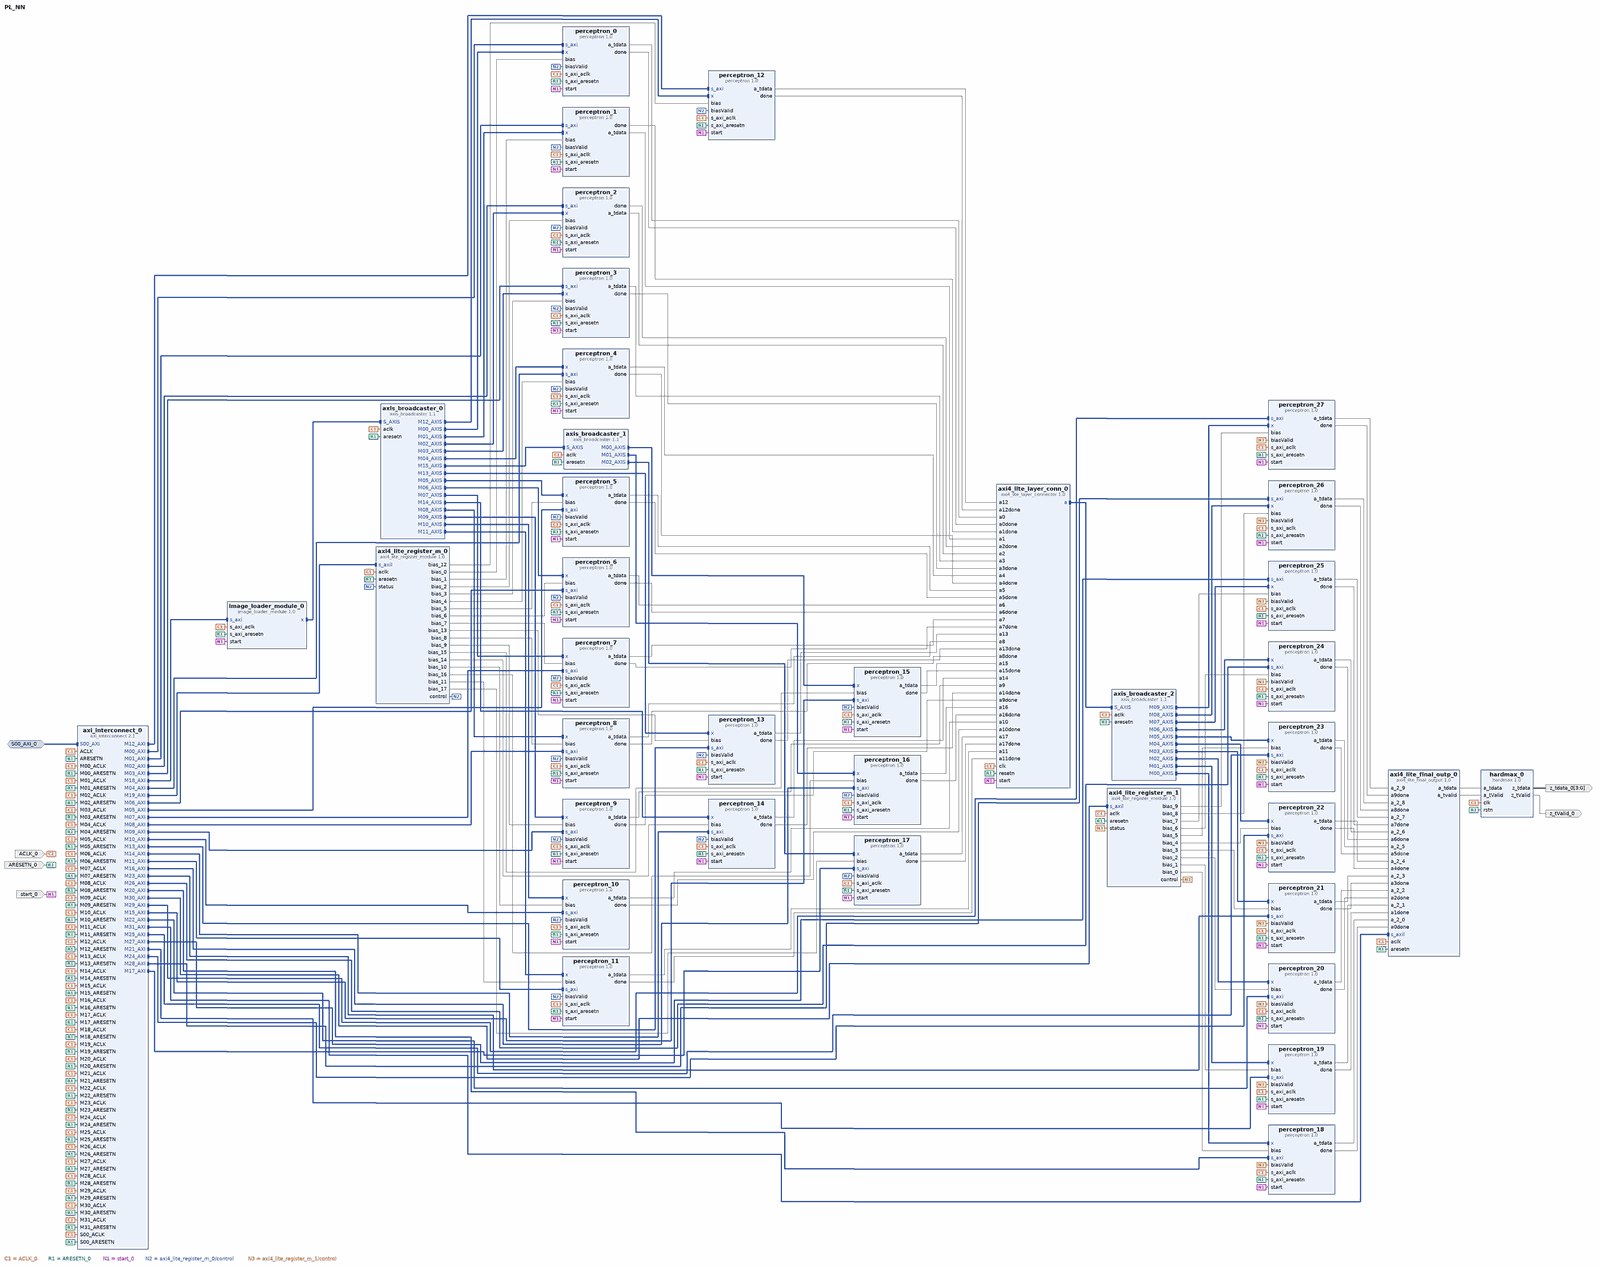
[diagram p0: block diagram of the top level, whole]
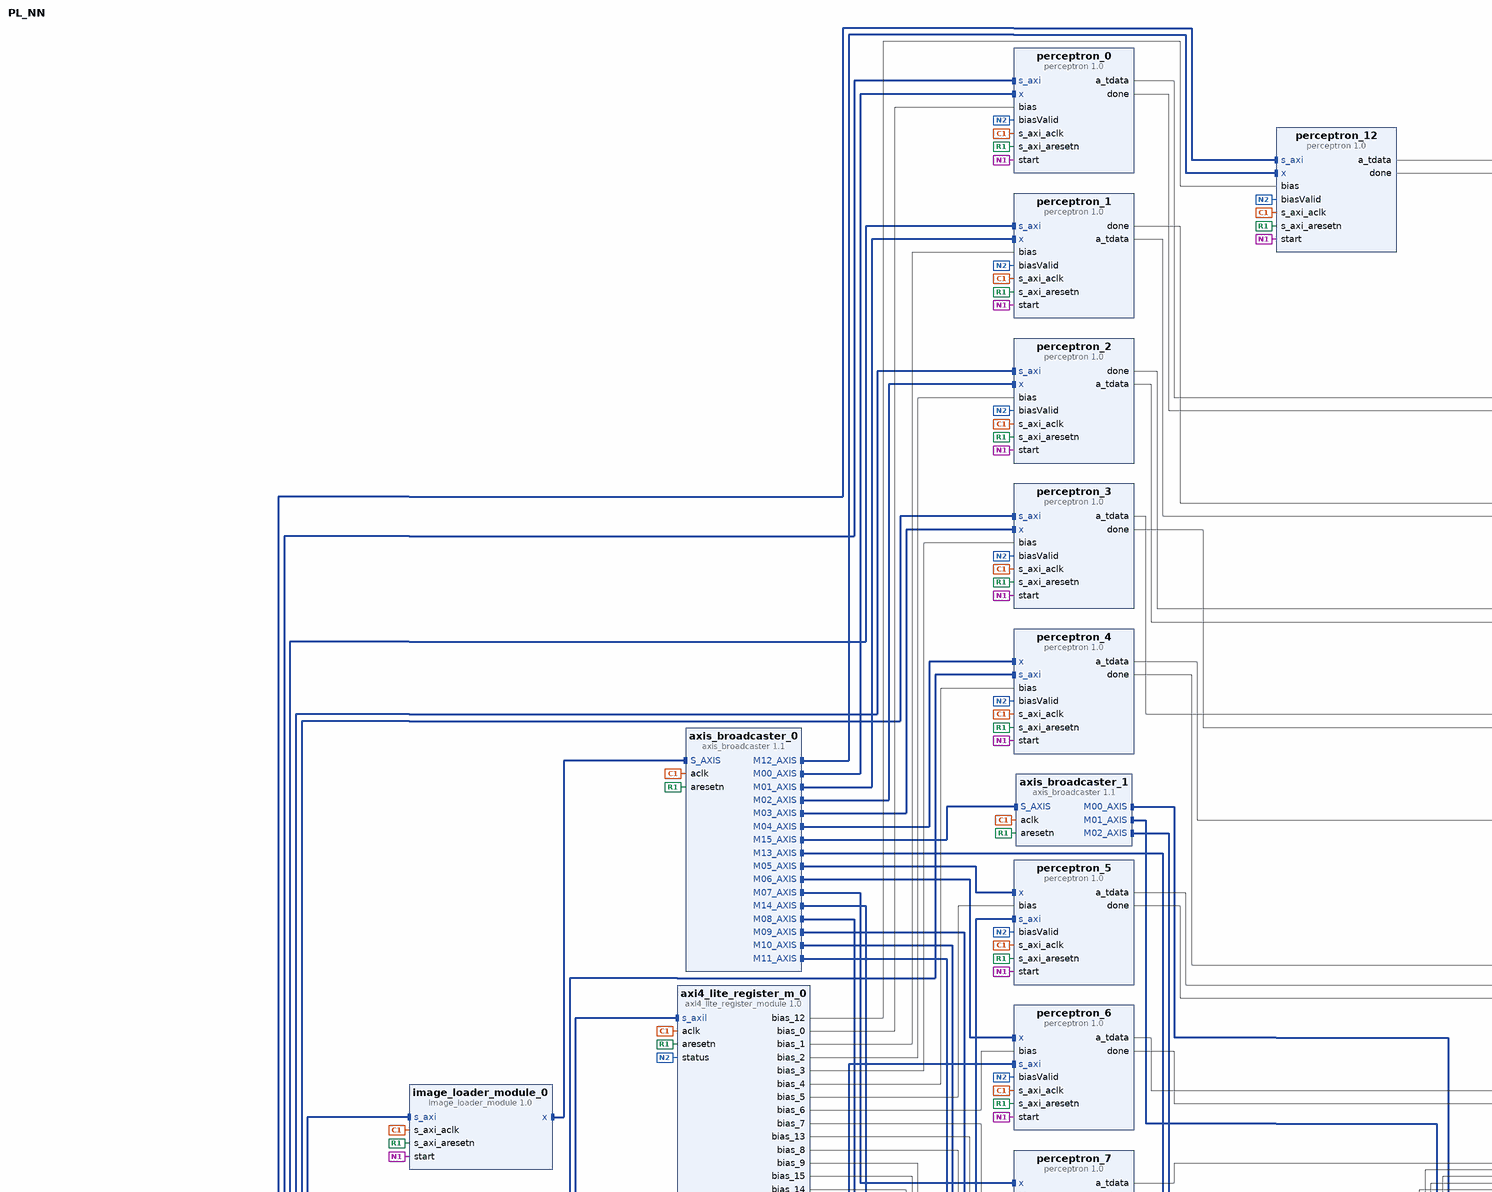
[diagram p1: block diagram of the top level, upper left part]
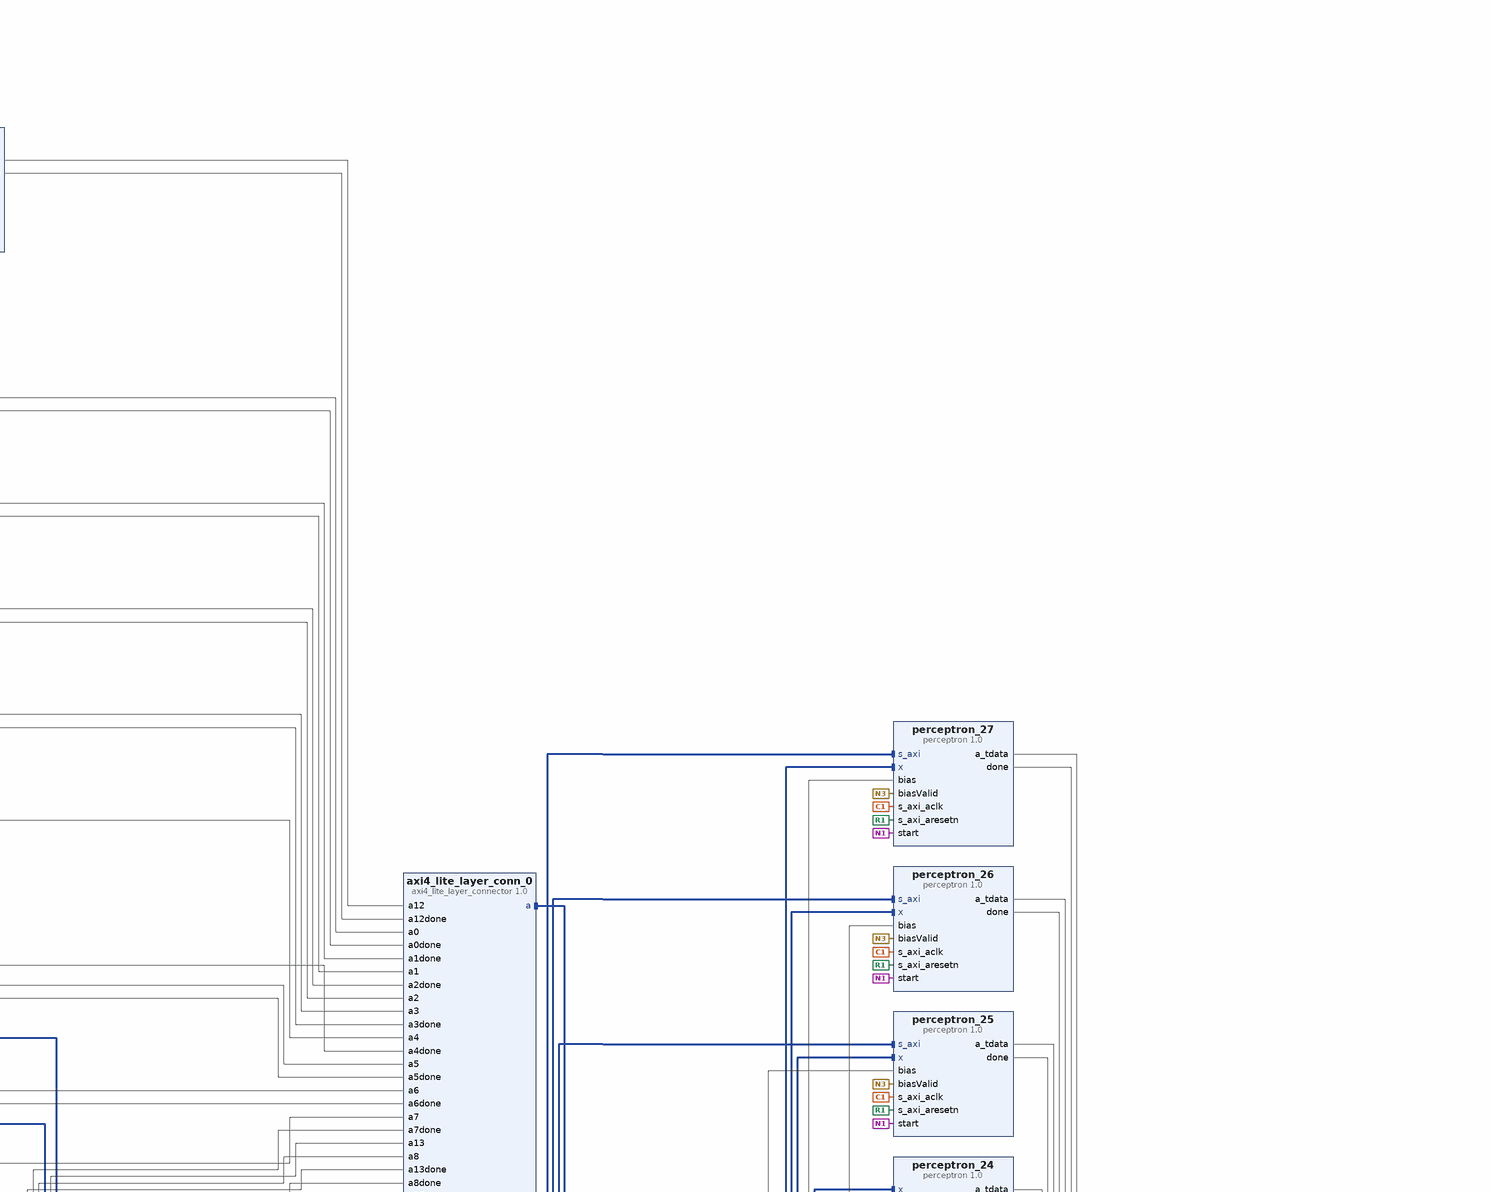
[diagram p2: block diagram of the top level, upper right part]
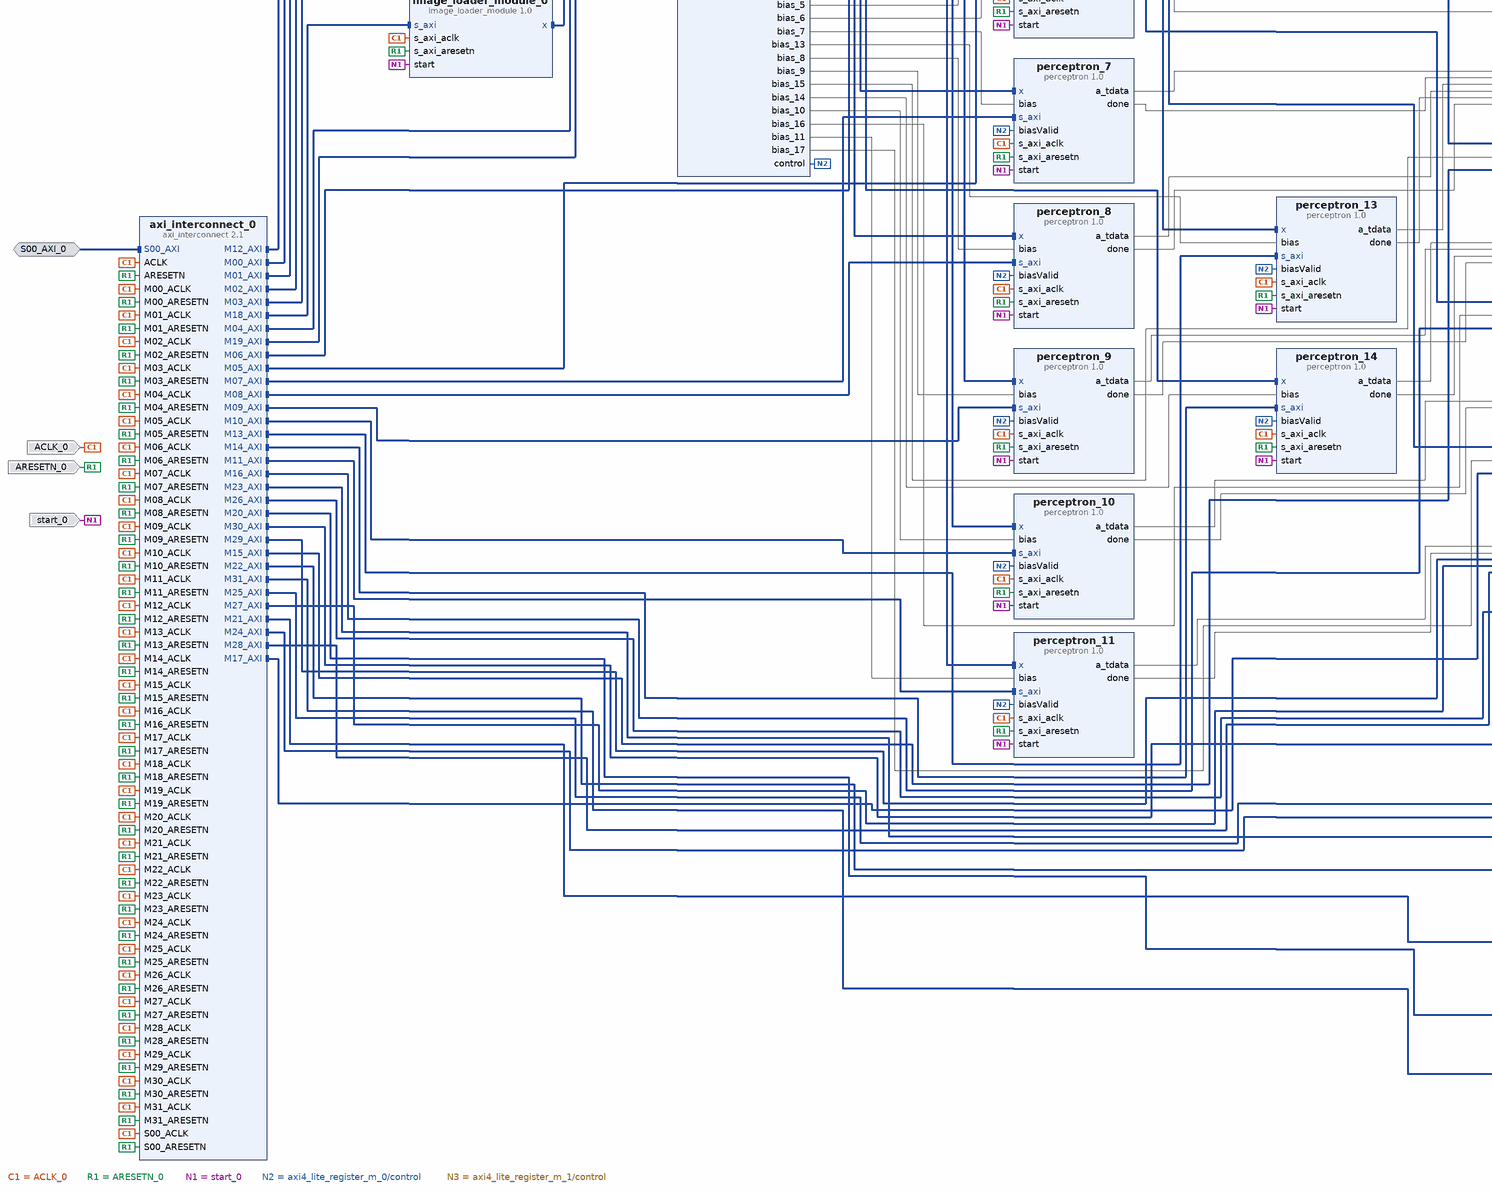
[diagram p3: block diagram of the top level, lower left part]
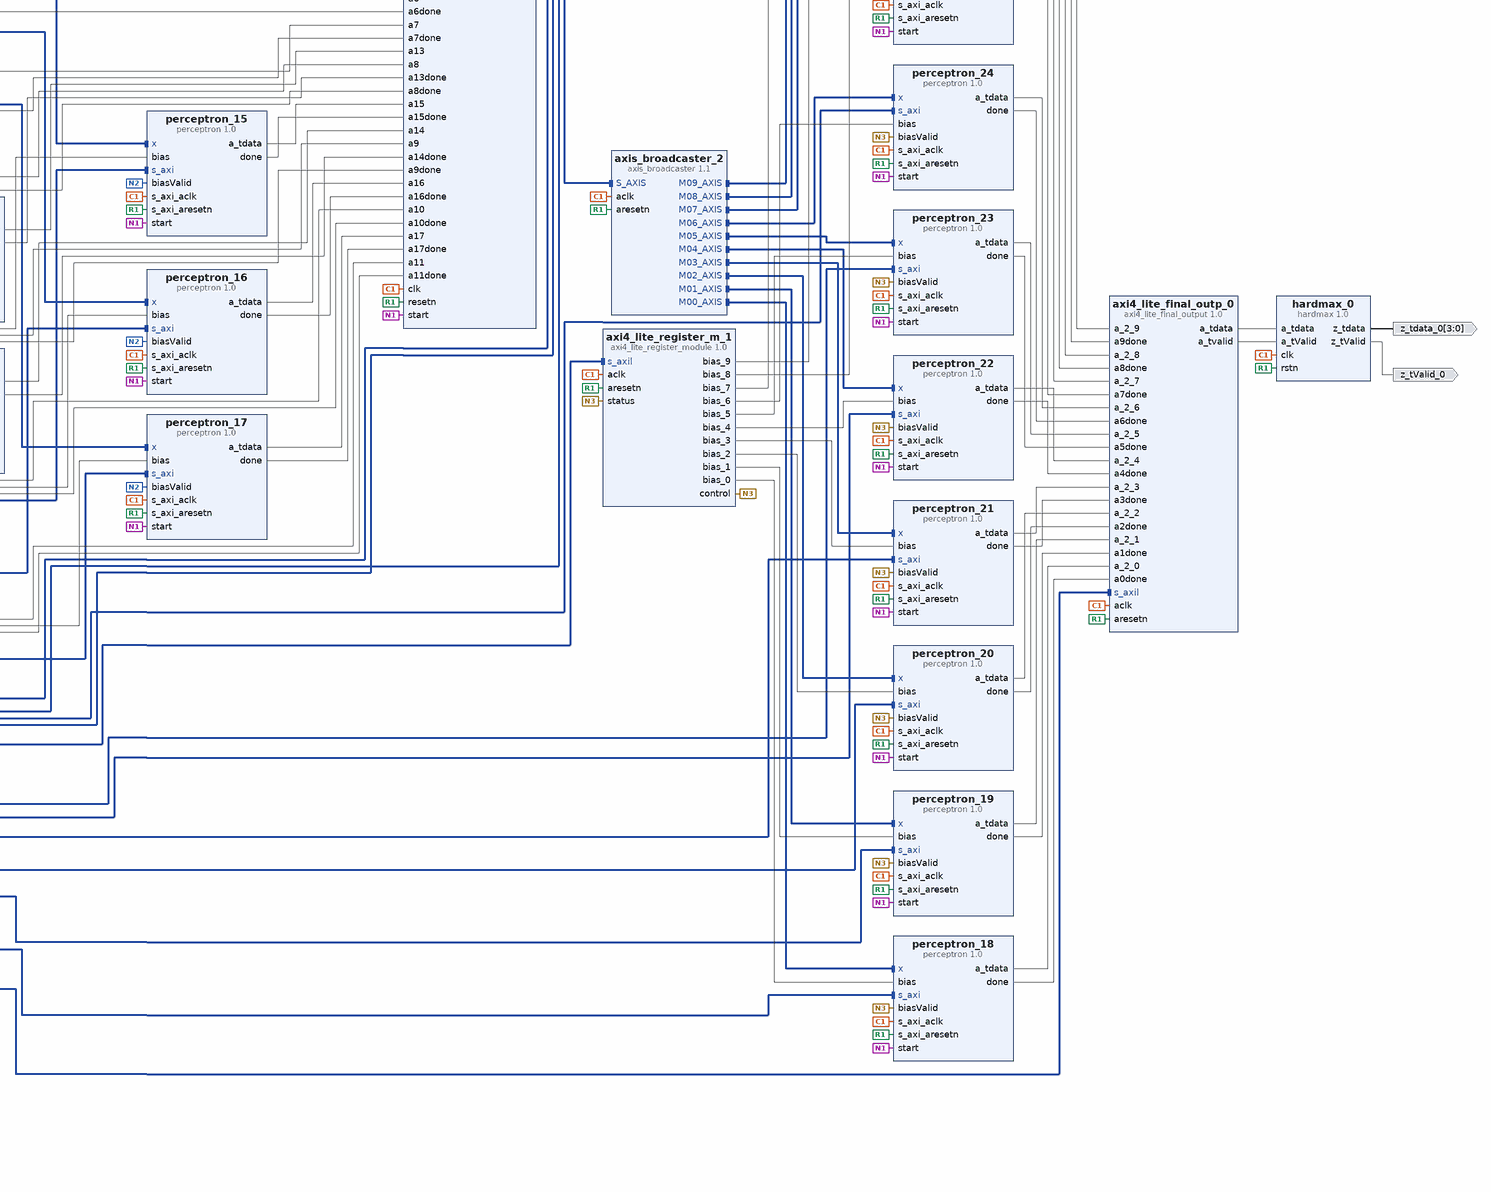
[diagram p4: block diagram of the top level, lower right part]
# Vivado block design PL_NN, xc7z010clg400-1, Vivado 2019.2
create_bd_design PL_NN

create_bd_intf_port -mode Slave -vlnv xilinx.com:interface:aximm_rtl:1.0 S00_AXI_0
set_property -dict [list \
  CONFIG.DATA_WIDTH 32 \
  CONFIG.PROTOCOL AXI4LITE \
  CONFIG.FREQ_HZ 10000000 \
  CONFIG.ID_WIDTH 0 \
  CONFIG.ADDR_WIDTH 24 \
  CONFIG.AWUSER_WIDTH 0 \
  CONFIG.ARUSER_WIDTH 0 \
  CONFIG.WUSER_WIDTH 0 \
  CONFIG.RUSER_WIDTH 0 \
  CONFIG.BUSER_WIDTH 0 \
  CONFIG.READ_WRITE_MODE READ_WRITE \
  CONFIG.HAS_BURST 1 \
  CONFIG.HAS_LOCK 1 \
  CONFIG.HAS_PROT 1 \
  CONFIG.HAS_CACHE 1 \
  CONFIG.HAS_QOS 1 \
  CONFIG.HAS_REGION 0 \
  CONFIG.HAS_WSTRB 1 \
  CONFIG.HAS_BRESP 1 \
  CONFIG.HAS_RRESP 1 \
  CONFIG.SUPPORTS_NARROW_BURST 0 \
  CONFIG.NUM_READ_OUTSTANDING 2 \
  CONFIG.NUM_WRITE_OUTSTANDING 2 \
  CONFIG.MAX_BURST_LENGTH 1 \
  CONFIG.NUM_READ_THREADS 1 \
  CONFIG.NUM_WRITE_THREADS 1 \
  CONFIG.RUSER_BITS_PER_BYTE 0 \
  CONFIG.WUSER_BITS_PER_BYTE 0 \
] [get_bd_intf_ports S00_AXI_0]
create_bd_port -dir I -type clk ACLK_0
set_property -dict {CONFIG.FREQ_HZ 10000000} [get_bd_ports ACLK_0]
create_bd_port -dir I -type rst ARESETN_0
create_bd_port -dir I start_0
create_bd_port -dir O z_tValid_0
create_bd_port -dir O -from 3 -to 0 z_tdata_0

create_bd_cell -type ip -vlnv xilinx.com:ip:axis_broadcaster:1.1 axis_broadcaster_0
set_property -dict [list \
  CONFIG.M02_TDATA_REMAP {tdata[31:0]} \
  CONFIG.M03_TDATA_REMAP {tdata[31:0]} \
  CONFIG.M04_TDATA_REMAP {tdata[31:0]} \
  CONFIG.M05_TDATA_REMAP {tdata[31:0]} \
  CONFIG.M06_TDATA_REMAP {tdata[31:0]} \
  CONFIG.M07_TDATA_REMAP {tdata[31:0]} \
  CONFIG.M08_TDATA_REMAP {tdata[31:0]} \
  CONFIG.M09_TDATA_REMAP {tdata[31:0]} \
  CONFIG.M10_TDATA_REMAP {tdata[31:0]} \
  CONFIG.M11_TDATA_REMAP {tdata[31:0]} \
  CONFIG.M12_TDATA_REMAP {tdata[31:0]} \
  CONFIG.M13_TDATA_REMAP {tdata[31:0]} \
  CONFIG.M14_TDATA_REMAP {tdata[31:0]} \
  CONFIG.M15_TDATA_REMAP {tdata[31:0]} \
  CONFIG.NUM_MI 16 \
] [get_bd_cells axis_broadcaster_0]
create_bd_cell -type ip -vlnv xilinx.com:ip:axi_interconnect:2.1 axi_interconnect_0
set_property -dict {CONFIG.NUM_MI 32} [get_bd_cells axi_interconnect_0]
create_bd_cell -type ip -vlnv xilinx.com:user:image_loader_module:1.0 image_loader_module_0
create_bd_cell -type ip -vlnv xilinx.com:user:axi4_lite_layer_connector:1.0 axi4_lite_layer_conn_0
create_bd_cell -type ip -vlnv xilinx.com:ip:axis_broadcaster:1.1 axis_broadcaster_1
set_property -dict {CONFIG.M02_TDATA_REMAP {tdata[31:0]} CONFIG.NUM_MI 3} [get_bd_cells axis_broadcaster_1]
create_bd_cell -type ip -vlnv xilinx.com:ip:axis_broadcaster:1.1 axis_broadcaster_2
set_property -dict [list \
  CONFIG.M02_TDATA_REMAP {tdata[31:0]} \
  CONFIG.M03_TDATA_REMAP {tdata[31:0]} \
  CONFIG.M04_TDATA_REMAP {tdata[31:0]} \
  CONFIG.M05_TDATA_REMAP {tdata[31:0]} \
  CONFIG.M06_TDATA_REMAP {tdata[31:0]} \
  CONFIG.M07_TDATA_REMAP {tdata[31:0]} \
  CONFIG.M08_TDATA_REMAP {tdata[31:0]} \
  CONFIG.M09_TDATA_REMAP {tdata[31:0]} \
  CONFIG.M10_TDATA_REMAP {tdata[31:0]} \
  CONFIG.M11_TDATA_REMAP {tdata[31:0]} \
  CONFIG.M12_TDATA_REMAP {tdata[31:0]} \
  CONFIG.M13_TDATA_REMAP {tdata[31:0]} \
  CONFIG.M14_TDATA_REMAP {tdata[31:0]} \
  CONFIG.M15_TDATA_REMAP {tdata[31:0]} \
  CONFIG.NUM_MI 10 \
] [get_bd_cells axis_broadcaster_2]
create_bd_cell -type ip -vlnv xilinx.com:user:axi4_lite_final_output:1.0 axi4_lite_final_outp_0
create_bd_cell -type ip -vlnv xilinx.com:user:hardmax:1.0 hardmax_0
create_bd_cell -type ip -vlnv xilinx.com:user:axi4_lite_register_module:1.0 axi4_lite_register_m_0
create_bd_cell -type ip -vlnv xilinx.com:user:axi4_lite_register_module:1.0 axi4_lite_register_m_1
create_bd_cell -type ip -vlnv xilinx.com:user:perceptron:1.0 perceptron_0
create_bd_cell -type ip -vlnv xilinx.com:user:perceptron:1.0 perceptron_1
create_bd_cell -type ip -vlnv xilinx.com:user:perceptron:1.0 perceptron_2
create_bd_cell -type ip -vlnv xilinx.com:user:perceptron:1.0 perceptron_18
create_bd_cell -type ip -vlnv xilinx.com:user:perceptron:1.0 perceptron_19
create_bd_cell -type ip -vlnv xilinx.com:user:perceptron:1.0 perceptron_3
create_bd_cell -type ip -vlnv xilinx.com:user:perceptron:1.0 perceptron_4
create_bd_cell -type ip -vlnv xilinx.com:user:perceptron:1.0 perceptron_5
create_bd_cell -type ip -vlnv xilinx.com:user:perceptron:1.0 perceptron_6
create_bd_cell -type ip -vlnv xilinx.com:user:perceptron:1.0 perceptron_7
create_bd_cell -type ip -vlnv xilinx.com:user:perceptron:1.0 perceptron_8
create_bd_cell -type ip -vlnv xilinx.com:user:perceptron:1.0 perceptron_9
create_bd_cell -type ip -vlnv xilinx.com:user:perceptron:1.0 perceptron_20
create_bd_cell -type ip -vlnv xilinx.com:user:perceptron:1.0 perceptron_21
create_bd_cell -type ip -vlnv xilinx.com:user:perceptron:1.0 perceptron_22
create_bd_cell -type ip -vlnv xilinx.com:user:perceptron:1.0 perceptron_23
create_bd_cell -type ip -vlnv xilinx.com:user:perceptron:1.0 perceptron_24
create_bd_cell -type ip -vlnv xilinx.com:user:perceptron:1.0 perceptron_25
create_bd_cell -type ip -vlnv xilinx.com:user:perceptron:1.0 perceptron_26
create_bd_cell -type ip -vlnv xilinx.com:user:perceptron:1.0 perceptron_10
create_bd_cell -type ip -vlnv xilinx.com:user:perceptron:1.0 perceptron_11
create_bd_cell -type ip -vlnv xilinx.com:user:perceptron:1.0 perceptron_12
create_bd_cell -type ip -vlnv xilinx.com:user:perceptron:1.0 perceptron_13
create_bd_cell -type ip -vlnv xilinx.com:user:perceptron:1.0 perceptron_14
create_bd_cell -type ip -vlnv xilinx.com:user:perceptron:1.0 perceptron_15
create_bd_cell -type ip -vlnv xilinx.com:user:perceptron:1.0 perceptron_16
create_bd_cell -type ip -vlnv xilinx.com:user:perceptron:1.0 perceptron_17
create_bd_cell -type ip -vlnv xilinx.com:user:perceptron:1.0 perceptron_27

# ---- connections ----

connect_bd_intf_net [get_bd_intf_pins image_loader_module_0/x] [get_bd_intf_pins axis_broadcaster_0/S_AXIS]
connect_bd_intf_net [get_bd_intf_pins axi_interconnect_0/M00_AXI] [get_bd_intf_pins perceptron_0/s_axi]
connect_bd_intf_net [get_bd_intf_pins axis_broadcaster_0/M01_AXIS] [get_bd_intf_pins perceptron_1/x]
connect_bd_intf_net -intf_net S00_AXI_0_1 [get_bd_intf_ports S00_AXI_0] [get_bd_intf_pins axi_interconnect_0/S00_AXI]
connect_bd_intf_net [get_bd_intf_pins axi_interconnect_0/M20_AXI] [get_bd_intf_pins perceptron_18/s_axi]
connect_bd_intf_net [get_bd_intf_pins axi_interconnect_0/M01_AXI] [get_bd_intf_pins perceptron_1/s_axi]
connect_bd_intf_net [get_bd_intf_pins axi_interconnect_0/M04_AXI] [get_bd_intf_pins perceptron_4/s_axi]
connect_bd_intf_net [get_bd_intf_pins axi_interconnect_0/M09_AXI] [get_bd_intf_pins perceptron_9/s_axi]
connect_bd_intf_net [get_bd_intf_pins axi_interconnect_0/M02_AXI] [get_bd_intf_pins perceptron_2/s_axi]
connect_bd_intf_net [get_bd_intf_pins axis_broadcaster_0/M00_AXIS] [get_bd_intf_pins perceptron_0/x]
connect_bd_intf_net [get_bd_intf_pins axi_interconnect_0/M16_AXI] [get_bd_intf_pins perceptron_16/s_axi]
connect_bd_intf_net [get_bd_intf_pins axi_interconnect_0/M23_AXI] [get_bd_intf_pins perceptron_21/s_axi]
connect_bd_intf_net [get_bd_intf_pins axis_broadcaster_2/M07_AXIS] [get_bd_intf_pins perceptron_25/x]
connect_bd_intf_net [get_bd_intf_pins axis_broadcaster_2/M01_AXIS] [get_bd_intf_pins perceptron_19/x]
connect_bd_intf_net [get_bd_intf_pins axis_broadcaster_2/S_AXIS] [get_bd_intf_pins axi4_lite_layer_conn_0/a]
connect_bd_intf_net [get_bd_intf_pins axis_broadcaster_0/M03_AXIS] [get_bd_intf_pins perceptron_3/x]
connect_bd_intf_net [get_bd_intf_pins axis_broadcaster_2/M03_AXIS] [get_bd_intf_pins perceptron_21/x]
connect_bd_intf_net [get_bd_intf_pins axis_broadcaster_2/M02_AXIS] [get_bd_intf_pins perceptron_20/x]
connect_bd_intf_net [get_bd_intf_pins axi_interconnect_0/M26_AXI] [get_bd_intf_pins perceptron_24/s_axi]
connect_bd_intf_net [get_bd_intf_pins axis_broadcaster_0/M13_AXIS] [get_bd_intf_pins perceptron_13/x]
connect_bd_intf_net [get_bd_intf_pins axi_interconnect_0/M06_AXI] [get_bd_intf_pins perceptron_6/s_axi]
connect_bd_intf_net [get_bd_intf_pins axis_broadcaster_2/M09_AXIS] [get_bd_intf_pins perceptron_27/x]
connect_bd_intf_net [get_bd_intf_pins axi_interconnect_0/M07_AXI] [get_bd_intf_pins perceptron_7/s_axi]
connect_bd_intf_net [get_bd_intf_pins axis_broadcaster_2/M00_AXIS] [get_bd_intf_pins perceptron_18/x]
connect_bd_intf_net [get_bd_intf_pins axi_interconnect_0/M30_AXI] [get_bd_intf_pins axi4_lite_register_m_1/s_axil]
connect_bd_intf_net [get_bd_intf_pins axi_interconnect_0/M22_AXI] [get_bd_intf_pins perceptron_20/s_axi]
connect_bd_intf_net [get_bd_intf_pins axi_interconnect_0/M29_AXI] [get_bd_intf_pins perceptron_27/s_axi]
connect_bd_intf_net [get_bd_intf_pins axi_interconnect_0/M14_AXI] [get_bd_intf_pins perceptron_14/s_axi]
connect_bd_intf_net [get_bd_intf_pins axi_interconnect_0/M31_AXI] [get_bd_intf_pins axi4_lite_final_outp_0/s_axil]
connect_bd_intf_net [get_bd_intf_pins axis_broadcaster_1/M02_AXIS] [get_bd_intf_pins perceptron_17/x]
connect_bd_intf_net [get_bd_intf_pins axis_broadcaster_2/M04_AXIS] [get_bd_intf_pins perceptron_22/x]
connect_bd_intf_net [get_bd_intf_pins axi_interconnect_0/M08_AXI] [get_bd_intf_pins perceptron_8/s_axi]
connect_bd_intf_net [get_bd_intf_pins axi_interconnect_0/M19_AXI] [get_bd_intf_pins axi4_lite_register_m_0/s_axil]
connect_bd_intf_net [get_bd_intf_pins axi_interconnect_0/M12_AXI] [get_bd_intf_pins perceptron_12/s_axi]
connect_bd_intf_net [get_bd_intf_pins axis_broadcaster_0/M05_AXIS] [get_bd_intf_pins perceptron_5/x]
connect_bd_intf_net [get_bd_intf_pins axis_broadcaster_0/M14_AXIS] [get_bd_intf_pins perceptron_14/x]
connect_bd_intf_net [get_bd_intf_pins axis_broadcaster_0/M09_AXIS] [get_bd_intf_pins perceptron_9/x]
connect_bd_intf_net [get_bd_intf_pins axis_broadcaster_0/M11_AXIS] [get_bd_intf_pins perceptron_11/x]
connect_bd_intf_net [get_bd_intf_pins axis_broadcaster_1/M01_AXIS] [get_bd_intf_pins perceptron_16/x]
connect_bd_intf_net [get_bd_intf_pins axis_broadcaster_2/M06_AXIS] [get_bd_intf_pins perceptron_24/x]
connect_bd_intf_net [get_bd_intf_pins axi_interconnect_0/M18_AXI] [get_bd_intf_pins image_loader_module_0/s_axi]
connect_bd_intf_net [get_bd_intf_pins axi_interconnect_0/M25_AXI] [get_bd_intf_pins perceptron_23/s_axi]
connect_bd_intf_net [get_bd_intf_pins axis_broadcaster_2/M08_AXIS] [get_bd_intf_pins perceptron_26/x]
connect_bd_intf_net [get_bd_intf_pins axi_interconnect_0/M27_AXI] [get_bd_intf_pins perceptron_25/s_axi]
connect_bd_intf_net [get_bd_intf_pins axi_interconnect_0/M21_AXI] [get_bd_intf_pins perceptron_19/s_axi]
connect_bd_intf_net [get_bd_intf_pins axis_broadcaster_0/M08_AXIS] [get_bd_intf_pins perceptron_8/x]
connect_bd_intf_net [get_bd_intf_pins axi_interconnect_0/M03_AXI] [get_bd_intf_pins perceptron_3/s_axi]
connect_bd_intf_net [get_bd_intf_pins axi_interconnect_0/M05_AXI] [get_bd_intf_pins perceptron_5/s_axi]
connect_bd_intf_net [get_bd_intf_pins axi_interconnect_0/M24_AXI] [get_bd_intf_pins perceptron_22/s_axi]
connect_bd_intf_net [get_bd_intf_pins axis_broadcaster_0/M15_AXIS] [get_bd_intf_pins axis_broadcaster_1/S_AXIS]
connect_bd_intf_net [get_bd_intf_pins axi_interconnect_0/M11_AXI] [get_bd_intf_pins perceptron_11/s_axi]
connect_bd_intf_net [get_bd_intf_pins axis_broadcaster_2/M05_AXIS] [get_bd_intf_pins perceptron_23/x]
connect_bd_intf_net [get_bd_intf_pins axi_interconnect_0/M10_AXI] [get_bd_intf_pins perceptron_10/s_axi]
connect_bd_intf_net [get_bd_intf_pins axis_broadcaster_0/M04_AXIS] [get_bd_intf_pins perceptron_4/x]
connect_bd_intf_net [get_bd_intf_pins axis_broadcaster_0/M12_AXIS] [get_bd_intf_pins perceptron_12/x]
connect_bd_intf_net [get_bd_intf_pins axis_broadcaster_0/M07_AXIS] [get_bd_intf_pins perceptron_7/x]
connect_bd_intf_net [get_bd_intf_pins axis_broadcaster_0/M10_AXIS] [get_bd_intf_pins perceptron_10/x]
connect_bd_intf_net [get_bd_intf_pins axis_broadcaster_1/M00_AXIS] [get_bd_intf_pins perceptron_15/x]
connect_bd_intf_net [get_bd_intf_pins axi_interconnect_0/M13_AXI] [get_bd_intf_pins perceptron_13/s_axi]
connect_bd_intf_net [get_bd_intf_pins axi_interconnect_0/M15_AXI] [get_bd_intf_pins perceptron_15/s_axi]
connect_bd_intf_net [get_bd_intf_pins axi_interconnect_0/M28_AXI] [get_bd_intf_pins perceptron_26/s_axi]
connect_bd_intf_net [get_bd_intf_pins axis_broadcaster_0/M06_AXIS] [get_bd_intf_pins perceptron_6/x]
connect_bd_intf_net [get_bd_intf_pins axi_interconnect_0/M17_AXI] [get_bd_intf_pins perceptron_17/s_axi]
connect_bd_intf_net [get_bd_intf_pins axis_broadcaster_0/M02_AXIS] [get_bd_intf_pins perceptron_2/x]
connect_bd_net [get_bd_pins perceptron_0/a_tdata] [get_bd_pins axi4_lite_layer_conn_0/a0]
connect_bd_net [get_bd_pins perceptron_0/done] [get_bd_pins axi4_lite_layer_conn_0/a0done]
connect_bd_net [get_bd_pins perceptron_1/done] [get_bd_pins axi4_lite_layer_conn_0/a1done]
connect_bd_net [get_bd_pins perceptron_2/done] [get_bd_pins axi4_lite_layer_conn_0/a2done]
connect_bd_net -net ACLK_0_1 [get_bd_ports ACLK_0] \
  [get_bd_pins axi_interconnect_0/ACLK] [get_bd_pins axi_interconnect_0/S00_ACLK] [get_bd_pins axi_interconnect_0/M00_ACLK] \
  [get_bd_pins axi_interconnect_0/M01_ACLK] [get_bd_pins axi_interconnect_0/M02_ACLK] \
  [get_bd_pins axi_interconnect_0/M03_ACLK] [get_bd_pins axi_interconnect_0/M04_ACLK] [get_bd_pins axis_broadcaster_0/aclk] \
  [get_bd_pins image_loader_module_0/s_axi_aclk] [get_bd_pins axi4_lite_layer_conn_0/clk] \
  [get_bd_pins axis_broadcaster_1/aclk] [get_bd_pins axis_broadcaster_2/aclk] [get_bd_pins axi4_lite_final_outp_0/aclk] \
  [get_bd_pins hardmax_0/clk] [get_bd_pins axi_interconnect_0/M05_ACLK] [get_bd_pins axi_interconnect_0/M06_ACLK] \
  [get_bd_pins axi_interconnect_0/M07_ACLK] [get_bd_pins axi_interconnect_0/M08_ACLK] \
  [get_bd_pins axi_interconnect_0/M09_ACLK] [get_bd_pins axi_interconnect_0/M10_ACLK] \
  [get_bd_pins axi_interconnect_0/M11_ACLK] [get_bd_pins axi_interconnect_0/M12_ACLK] \
  [get_bd_pins axi_interconnect_0/M13_ACLK] [get_bd_pins axi_interconnect_0/M14_ACLK] \
  [get_bd_pins axi_interconnect_0/M15_ACLK] [get_bd_pins axi_interconnect_0/M16_ACLK] \
  [get_bd_pins axi_interconnect_0/M17_ACLK] [get_bd_pins axi_interconnect_0/M18_ACLK] \
  [get_bd_pins axi_interconnect_0/M19_ACLK] [get_bd_pins axi_interconnect_0/M20_ACLK] \
  [get_bd_pins axi_interconnect_0/M21_ACLK] [get_bd_pins axi_interconnect_0/M22_ACLK] \
  [get_bd_pins axi_interconnect_0/M23_ACLK] [get_bd_pins axi_interconnect_0/M24_ACLK] \
  [get_bd_pins axi_interconnect_0/M25_ACLK] [get_bd_pins axi_interconnect_0/M26_ACLK] \
  [get_bd_pins axi_interconnect_0/M27_ACLK] [get_bd_pins axi_interconnect_0/M28_ACLK] \
  [get_bd_pins axi_interconnect_0/M29_ACLK] [get_bd_pins axi_interconnect_0/M30_ACLK] \
  [get_bd_pins axi_interconnect_0/M31_ACLK] [get_bd_pins axi4_lite_register_m_0/aclk] \
  [get_bd_pins axi4_lite_register_m_1/aclk] [get_bd_pins perceptron_0/s_axi_aclk] [get_bd_pins perceptron_1/s_axi_aclk] \
  [get_bd_pins perceptron_2/s_axi_aclk] [get_bd_pins perceptron_18/s_axi_aclk] [get_bd_pins perceptron_19/s_axi_aclk] \
  [get_bd_pins perceptron_3/s_axi_aclk] [get_bd_pins perceptron_4/s_axi_aclk] [get_bd_pins perceptron_5/s_axi_aclk] \
  [get_bd_pins perceptron_6/s_axi_aclk] [get_bd_pins perceptron_7/s_axi_aclk] [get_bd_pins perceptron_8/s_axi_aclk] \
  [get_bd_pins perceptron_9/s_axi_aclk] [get_bd_pins perceptron_20/s_axi_aclk] [get_bd_pins perceptron_21/s_axi_aclk] \
  [get_bd_pins perceptron_22/s_axi_aclk] [get_bd_pins perceptron_23/s_axi_aclk] [get_bd_pins perceptron_24/s_axi_aclk] \
  [get_bd_pins perceptron_25/s_axi_aclk] [get_bd_pins perceptron_26/s_axi_aclk] [get_bd_pins perceptron_10/s_axi_aclk] \
  [get_bd_pins perceptron_11/s_axi_aclk] [get_bd_pins perceptron_12/s_axi_aclk] [get_bd_pins perceptron_13/s_axi_aclk] \
  [get_bd_pins perceptron_14/s_axi_aclk] [get_bd_pins perceptron_15/s_axi_aclk] [get_bd_pins perceptron_16/s_axi_aclk] \
  [get_bd_pins perceptron_17/s_axi_aclk] [get_bd_pins perceptron_27/s_axi_aclk]
connect_bd_net -net ARESETN_0_1 [get_bd_ports ARESETN_0] \
  [get_bd_pins axi_interconnect_0/ARESETN] [get_bd_pins axi_interconnect_0/S00_ARESETN] \
  [get_bd_pins axi_interconnect_0/M00_ARESETN] [get_bd_pins axi_interconnect_0/M01_ARESETN] \
  [get_bd_pins axi_interconnect_0/M02_ARESETN] [get_bd_pins axi_interconnect_0/M03_ARESETN] \
  [get_bd_pins axi_interconnect_0/M04_ARESETN] [get_bd_pins axis_broadcaster_0/aresetn] \
  [get_bd_pins image_loader_module_0/s_axi_aresetn] [get_bd_pins axi4_lite_layer_conn_0/resetn] \
  [get_bd_pins axis_broadcaster_1/aresetn] [get_bd_pins axis_broadcaster_2/aresetn] \
  [get_bd_pins axi4_lite_final_outp_0/aresetn] [get_bd_pins hardmax_0/rstn] [get_bd_pins axi_interconnect_0/M05_ARESETN] \
  [get_bd_pins axi_interconnect_0/M06_ARESETN] [get_bd_pins axi_interconnect_0/M07_ARESETN] \
  [get_bd_pins axi_interconnect_0/M08_ARESETN] [get_bd_pins axi_interconnect_0/M09_ARESETN] \
  [get_bd_pins axi_interconnect_0/M10_ARESETN] [get_bd_pins axi_interconnect_0/M11_ARESETN] \
  [get_bd_pins axi_interconnect_0/M12_ARESETN] [get_bd_pins axi_interconnect_0/M13_ARESETN] \
  [get_bd_pins axi_interconnect_0/M14_ARESETN] [get_bd_pins axi_interconnect_0/M15_ARESETN] \
  [get_bd_pins axi_interconnect_0/M16_ARESETN] [get_bd_pins axi_interconnect_0/M17_ARESETN] \
  [get_bd_pins axi_interconnect_0/M18_ARESETN] [get_bd_pins axi_interconnect_0/M19_ARESETN] \
  [get_bd_pins axi_interconnect_0/M20_ARESETN] [get_bd_pins axi_interconnect_0/M21_ARESETN] \
  [get_bd_pins axi_interconnect_0/M22_ARESETN] [get_bd_pins axi_interconnect_0/M23_ARESETN] \
  [get_bd_pins axi_interconnect_0/M24_ARESETN] [get_bd_pins axi_interconnect_0/M25_ARESETN] \
  [get_bd_pins axi_interconnect_0/M26_ARESETN] [get_bd_pins axi_interconnect_0/M27_ARESETN] \
  [get_bd_pins axi_interconnect_0/M28_ARESETN] [get_bd_pins axi_interconnect_0/M29_ARESETN] \
  [get_bd_pins axi_interconnect_0/M30_ARESETN] [get_bd_pins axi_interconnect_0/M31_ARESETN] \
  [get_bd_pins axi4_lite_register_m_0/aresetn] [get_bd_pins axi4_lite_register_m_1/aresetn] \
  [get_bd_pins perceptron_0/s_axi_aresetn] [get_bd_pins perceptron_1/s_axi_aresetn] [get_bd_pins perceptron_2/s_axi_aresetn] \
  [get_bd_pins perceptron_18/s_axi_aresetn] [get_bd_pins perceptron_19/s_axi_aresetn] \
  [get_bd_pins perceptron_3/s_axi_aresetn] [get_bd_pins perceptron_4/s_axi_aresetn] [get_bd_pins perceptron_5/s_axi_aresetn] \
  [get_bd_pins perceptron_6/s_axi_aresetn] [get_bd_pins perceptron_7/s_axi_aresetn] [get_bd_pins perceptron_8/s_axi_aresetn] \
  [get_bd_pins perceptron_9/s_axi_aresetn] [get_bd_pins perceptron_20/s_axi_aresetn] \
  [get_bd_pins perceptron_21/s_axi_aresetn] [get_bd_pins perceptron_22/s_axi_aresetn] \
  [get_bd_pins perceptron_23/s_axi_aresetn] [get_bd_pins perceptron_24/s_axi_aresetn] \
  [get_bd_pins perceptron_25/s_axi_aresetn] [get_bd_pins perceptron_26/s_axi_aresetn] \
  [get_bd_pins perceptron_10/s_axi_aresetn] [get_bd_pins perceptron_11/s_axi_aresetn] \
  [get_bd_pins perceptron_12/s_axi_aresetn] [get_bd_pins perceptron_13/s_axi_aresetn] \
  [get_bd_pins perceptron_14/s_axi_aresetn] [get_bd_pins perceptron_15/s_axi_aresetn] \
  [get_bd_pins perceptron_16/s_axi_aresetn] [get_bd_pins perceptron_17/s_axi_aresetn] \
  [get_bd_pins perceptron_27/s_axi_aresetn]
connect_bd_net -net start_0_1 [get_bd_ports start_0] \
  [get_bd_pins image_loader_module_0/start] [get_bd_pins axi4_lite_layer_conn_0/start] [get_bd_pins perceptron_0/start] \
  [get_bd_pins perceptron_1/start] [get_bd_pins perceptron_2/start] [get_bd_pins perceptron_18/start] \
  [get_bd_pins perceptron_19/start] [get_bd_pins perceptron_3/start] [get_bd_pins perceptron_4/start] \
  [get_bd_pins perceptron_5/start] [get_bd_pins perceptron_6/start] [get_bd_pins perceptron_7/start] \
  [get_bd_pins perceptron_8/start] [get_bd_pins perceptron_9/start] [get_bd_pins perceptron_20/start] \
  [get_bd_pins perceptron_21/start] [get_bd_pins perceptron_22/start] [get_bd_pins perceptron_23/start] \
  [get_bd_pins perceptron_24/start] [get_bd_pins perceptron_25/start] [get_bd_pins perceptron_26/start] \
  [get_bd_pins perceptron_10/start] [get_bd_pins perceptron_11/start] [get_bd_pins perceptron_12/start] \
  [get_bd_pins perceptron_13/start] [get_bd_pins perceptron_14/start] [get_bd_pins perceptron_15/start] \
  [get_bd_pins perceptron_16/start] [get_bd_pins perceptron_17/start] [get_bd_pins perceptron_27/start]
connect_bd_net [get_bd_pins perceptron_1/a_tdata] [get_bd_pins axi4_lite_layer_conn_0/a1]
connect_bd_net [get_bd_pins perceptron_2/a_tdata] [get_bd_pins axi4_lite_layer_conn_0/a2]
connect_bd_net [get_bd_pins axi4_lite_register_m_0/control] \
  [get_bd_pins axi4_lite_register_m_0/status] [get_bd_pins perceptron_0/biasValid] [get_bd_pins perceptron_1/biasValid] \
  [get_bd_pins perceptron_2/biasValid] [get_bd_pins perceptron_3/biasValid] [get_bd_pins perceptron_4/biasValid] \
  [get_bd_pins perceptron_5/biasValid] [get_bd_pins perceptron_6/biasValid] [get_bd_pins perceptron_7/biasValid] \
  [get_bd_pins perceptron_8/biasValid] [get_bd_pins perceptron_9/biasValid] [get_bd_pins perceptron_10/biasValid] \
  [get_bd_pins perceptron_11/biasValid] [get_bd_pins perceptron_12/biasValid] [get_bd_pins perceptron_13/biasValid] \
  [get_bd_pins perceptron_14/biasValid] [get_bd_pins perceptron_15/biasValid] [get_bd_pins perceptron_16/biasValid] \
  [get_bd_pins perceptron_17/biasValid]
connect_bd_net [get_bd_pins axi4_lite_register_m_0/bias_0] [get_bd_pins perceptron_0/bias]
connect_bd_net [get_bd_pins axi4_lite_register_m_0/bias_1] [get_bd_pins perceptron_1/bias]
connect_bd_net [get_bd_pins axi4_lite_register_m_0/bias_2] [get_bd_pins perceptron_2/bias]
connect_bd_net [get_bd_pins perceptron_3/a_tdata] [get_bd_pins axi4_lite_layer_conn_0/a3]
connect_bd_net [get_bd_pins perceptron_4/a_tdata] [get_bd_pins axi4_lite_layer_conn_0/a4]
connect_bd_net [get_bd_pins perceptron_5/a_tdata] [get_bd_pins axi4_lite_layer_conn_0/a5]
connect_bd_net [get_bd_pins perceptron_7/a_tdata] [get_bd_pins axi4_lite_layer_conn_0/a7]
connect_bd_net [get_bd_pins perceptron_8/a_tdata] [get_bd_pins axi4_lite_layer_conn_0/a8]
connect_bd_net [get_bd_pins perceptron_9/a_tdata] [get_bd_pins axi4_lite_layer_conn_0/a9]
connect_bd_net [get_bd_pins perceptron_10/a_tdata] [get_bd_pins axi4_lite_layer_conn_0/a10]
connect_bd_net [get_bd_pins perceptron_11/a_tdata] [get_bd_pins axi4_lite_layer_conn_0/a11]
connect_bd_net [get_bd_pins perceptron_12/a_tdata] [get_bd_pins axi4_lite_layer_conn_0/a12]
connect_bd_net [get_bd_pins perceptron_13/a_tdata] [get_bd_pins axi4_lite_layer_conn_0/a13]
connect_bd_net [get_bd_pins perceptron_14/a_tdata] [get_bd_pins axi4_lite_layer_conn_0/a14]
connect_bd_net [get_bd_pins perceptron_15/a_tdata] [get_bd_pins axi4_lite_layer_conn_0/a15]
connect_bd_net [get_bd_pins perceptron_16/a_tdata] [get_bd_pins axi4_lite_layer_conn_0/a16]
connect_bd_net [get_bd_pins perceptron_14/done] [get_bd_pins axi4_lite_layer_conn_0/a14done]
connect_bd_net [get_bd_pins perceptron_15/done] [get_bd_pins axi4_lite_layer_conn_0/a15done]
connect_bd_net [get_bd_pins perceptron_16/done] [get_bd_pins axi4_lite_layer_conn_0/a16done]
connect_bd_net [get_bd_pins perceptron_17/a_tdata] [get_bd_pins axi4_lite_layer_conn_0/a17]
connect_bd_net [get_bd_pins perceptron_17/done] [get_bd_pins axi4_lite_layer_conn_0/a17done]
connect_bd_net [get_bd_pins perceptron_13/done] [get_bd_pins axi4_lite_layer_conn_0/a13done]
connect_bd_net [get_bd_pins perceptron_12/done] [get_bd_pins axi4_lite_layer_conn_0/a12done]
connect_bd_net [get_bd_pins perceptron_11/done] [get_bd_pins axi4_lite_layer_conn_0/a11done]
connect_bd_net [get_bd_pins perceptron_10/done] [get_bd_pins axi4_lite_layer_conn_0/a10done]
connect_bd_net [get_bd_pins perceptron_3/done] [get_bd_pins axi4_lite_layer_conn_0/a3done]
connect_bd_net [get_bd_pins perceptron_4/done] [get_bd_pins axi4_lite_layer_conn_0/a4done]
connect_bd_net [get_bd_pins perceptron_5/done] [get_bd_pins axi4_lite_layer_conn_0/a5done]
connect_bd_net [get_bd_pins perceptron_6/a_tdata] [get_bd_pins axi4_lite_layer_conn_0/a6]
connect_bd_net [get_bd_pins perceptron_6/done] [get_bd_pins axi4_lite_layer_conn_0/a6done]
connect_bd_net [get_bd_pins perceptron_7/done] [get_bd_pins axi4_lite_layer_conn_0/a7done]
connect_bd_net [get_bd_pins perceptron_8/done] [get_bd_pins axi4_lite_layer_conn_0/a8done]
connect_bd_net [get_bd_pins perceptron_9/done] [get_bd_pins axi4_lite_layer_conn_0/a9done]
connect_bd_net [get_bd_pins axi4_lite_register_m_0/bias_3] [get_bd_pins perceptron_3/bias]
connect_bd_net [get_bd_pins axi4_lite_register_m_0/bias_4] [get_bd_pins perceptron_4/bias]
connect_bd_net [get_bd_pins axi4_lite_register_m_0/bias_5] [get_bd_pins perceptron_5/bias]
connect_bd_net [get_bd_pins axi4_lite_register_m_0/bias_6] [get_bd_pins perceptron_6/bias]
connect_bd_net [get_bd_pins axi4_lite_register_m_0/bias_7] [get_bd_pins perceptron_7/bias]
connect_bd_net [get_bd_pins axi4_lite_register_m_0/bias_8] [get_bd_pins perceptron_8/bias]
connect_bd_net [get_bd_pins axi4_lite_register_m_0/bias_9] [get_bd_pins perceptron_9/bias]
connect_bd_net [get_bd_pins axi4_lite_register_m_0/bias_10] [get_bd_pins perceptron_10/bias]
connect_bd_net [get_bd_pins axi4_lite_register_m_0/bias_11] [get_bd_pins perceptron_11/bias]
connect_bd_net [get_bd_pins axi4_lite_register_m_0/bias_12] [get_bd_pins perceptron_12/bias]
connect_bd_net [get_bd_pins axi4_lite_register_m_0/bias_13] [get_bd_pins perceptron_13/bias]
connect_bd_net [get_bd_pins axi4_lite_register_m_0/bias_14] [get_bd_pins perceptron_14/bias]
connect_bd_net [get_bd_pins axi4_lite_register_m_0/bias_15] [get_bd_pins perceptron_15/bias]
connect_bd_net [get_bd_pins axi4_lite_register_m_0/bias_16] [get_bd_pins perceptron_16/bias]
connect_bd_net [get_bd_pins axi4_lite_register_m_0/bias_17] [get_bd_pins perceptron_17/bias]
connect_bd_net [get_bd_pins axi4_lite_register_m_1/bias_0] [get_bd_pins perceptron_18/bias]
connect_bd_net [get_bd_pins axi4_lite_register_m_1/bias_1] [get_bd_pins perceptron_19/bias]
connect_bd_net [get_bd_pins axi4_lite_register_m_1/bias_2] [get_bd_pins perceptron_20/bias]
connect_bd_net [get_bd_pins axi4_lite_register_m_1/bias_3] [get_bd_pins perceptron_21/bias]
connect_bd_net [get_bd_pins axi4_lite_register_m_1/bias_4] [get_bd_pins perceptron_22/bias]
connect_bd_net [get_bd_pins axi4_lite_register_m_1/bias_5] [get_bd_pins perceptron_23/bias]
connect_bd_net [get_bd_pins axi4_lite_register_m_1/bias_6] [get_bd_pins perceptron_24/bias]
connect_bd_net [get_bd_pins axi4_lite_register_m_1/bias_7] [get_bd_pins perceptron_25/bias]
connect_bd_net [get_bd_pins axi4_lite_register_m_1/bias_8] [get_bd_pins perceptron_26/bias]
connect_bd_net [get_bd_pins axi4_lite_register_m_1/bias_9] [get_bd_pins perceptron_27/bias]
connect_bd_net [get_bd_pins axi4_lite_register_m_1/control] \
  [get_bd_pins axi4_lite_register_m_1/status] [get_bd_pins perceptron_18/biasValid] [get_bd_pins perceptron_19/biasValid] \
  [get_bd_pins perceptron_20/biasValid] [get_bd_pins perceptron_21/biasValid] [get_bd_pins perceptron_22/biasValid] \
  [get_bd_pins perceptron_23/biasValid] [get_bd_pins perceptron_24/biasValid] [get_bd_pins perceptron_25/biasValid] \
  [get_bd_pins perceptron_26/biasValid] [get_bd_pins perceptron_27/biasValid]
connect_bd_net [get_bd_pins perceptron_18/a_tdata] [get_bd_pins axi4_lite_final_outp_0/a_2_0]
connect_bd_net [get_bd_pins perceptron_19/a_tdata] [get_bd_pins axi4_lite_final_outp_0/a_2_1]
connect_bd_net [get_bd_pins perceptron_20/a_tdata] [get_bd_pins axi4_lite_final_outp_0/a_2_2]
connect_bd_net [get_bd_pins perceptron_21/a_tdata] [get_bd_pins axi4_lite_final_outp_0/a_2_3]
connect_bd_net [get_bd_pins perceptron_22/a_tdata] [get_bd_pins axi4_lite_final_outp_0/a_2_4]
connect_bd_net [get_bd_pins perceptron_23/a_tdata] [get_bd_pins axi4_lite_final_outp_0/a_2_5]
connect_bd_net [get_bd_pins perceptron_24/a_tdata] [get_bd_pins axi4_lite_final_outp_0/a_2_6]
connect_bd_net [get_bd_pins perceptron_25/a_tdata] [get_bd_pins axi4_lite_final_outp_0/a_2_7]
connect_bd_net [get_bd_pins perceptron_26/a_tdata] [get_bd_pins axi4_lite_final_outp_0/a_2_8]
connect_bd_net [get_bd_pins perceptron_27/a_tdata] [get_bd_pins axi4_lite_final_outp_0/a_2_9]
connect_bd_net [get_bd_pins perceptron_18/done] [get_bd_pins axi4_lite_final_outp_0/a0done]
connect_bd_net [get_bd_pins perceptron_19/done] [get_bd_pins axi4_lite_final_outp_0/a1done]
connect_bd_net [get_bd_pins perceptron_20/done] [get_bd_pins axi4_lite_final_outp_0/a2done]
connect_bd_net [get_bd_pins perceptron_21/done] [get_bd_pins axi4_lite_final_outp_0/a3done]
connect_bd_net [get_bd_pins perceptron_22/done] [get_bd_pins axi4_lite_final_outp_0/a4done]
connect_bd_net [get_bd_pins perceptron_23/done] [get_bd_pins axi4_lite_final_outp_0/a5done]
connect_bd_net [get_bd_pins perceptron_24/done] [get_bd_pins axi4_lite_final_outp_0/a6done]
connect_bd_net [get_bd_pins perceptron_25/done] [get_bd_pins axi4_lite_final_outp_0/a7done]
connect_bd_net [get_bd_pins perceptron_26/done] [get_bd_pins axi4_lite_final_outp_0/a8done]
connect_bd_net [get_bd_pins perceptron_27/done] [get_bd_pins axi4_lite_final_outp_0/a9done]
connect_bd_net [get_bd_pins axi4_lite_final_outp_0/a_tdata] [get_bd_pins hardmax_0/a_tdata]
connect_bd_net [get_bd_pins axi4_lite_final_outp_0/a_tvalid] [get_bd_pins hardmax_0/a_tValid]
connect_bd_net [get_bd_pins hardmax_0/z_tValid] [get_bd_ports z_tValid_0]
connect_bd_net [get_bd_pins hardmax_0/z_tdata] [get_bd_ports z_tdata_0]

# ---- address map ----
assign_bd_address -offset 0x000000 -range 4K -target_address_space [get_bd_addr_spaces S00_AXI_0] [get_bd_addr_segs perceptron_0/s_axi/reg0]
assign_bd_address -offset 0x001000 -range 4K -target_address_space [get_bd_addr_spaces S00_AXI_0] [get_bd_addr_segs perceptron_1/s_axi/reg0]
assign_bd_address -offset 0x002000 -range 4K -target_address_space [get_bd_addr_spaces S00_AXI_0] [get_bd_addr_segs perceptron_2/s_axi/reg0]
assign_bd_address -offset 0x003000 -range 4K -target_address_space [get_bd_addr_spaces S00_AXI_0] [get_bd_addr_segs perceptron_3/s_axi/reg0]
assign_bd_address -offset 0x004000 -range 4K -target_address_space [get_bd_addr_spaces S00_AXI_0] [get_bd_addr_segs perceptron_4/s_axi/reg0]
assign_bd_address -offset 0x005000 -range 4K -target_address_space [get_bd_addr_spaces S00_AXI_0] [get_bd_addr_segs perceptron_5/s_axi/reg0]
assign_bd_address -offset 0x006000 -range 4K -target_address_space [get_bd_addr_spaces S00_AXI_0] [get_bd_addr_segs perceptron_6/s_axi/reg0]
assign_bd_address -offset 0x007000 -range 4K -target_address_space [get_bd_addr_spaces S00_AXI_0] [get_bd_addr_segs perceptron_7/s_axi/reg0]
assign_bd_address -offset 0x008000 -range 4K -target_address_space [get_bd_addr_spaces S00_AXI_0] [get_bd_addr_segs perceptron_8/s_axi/reg0]
assign_bd_address -offset 0x009000 -range 4K -target_address_space [get_bd_addr_spaces S00_AXI_0] [get_bd_addr_segs perceptron_9/s_axi/reg0]
assign_bd_address -offset 0x00A000 -range 4K -target_address_space [get_bd_addr_spaces S00_AXI_0] [get_bd_addr_segs perceptron_10/s_axi/reg0]
assign_bd_address -offset 0x00B000 -range 4K -target_address_space [get_bd_addr_spaces S00_AXI_0] [get_bd_addr_segs perceptron_11/s_axi/reg0]
assign_bd_address -offset 0x00C000 -range 4K -target_address_space [get_bd_addr_spaces S00_AXI_0] [get_bd_addr_segs perceptron_12/s_axi/reg0]
assign_bd_address -offset 0x00D000 -range 4K -target_address_space [get_bd_addr_spaces S00_AXI_0] [get_bd_addr_segs perceptron_13/s_axi/reg0]
assign_bd_address -offset 0x00E000 -range 4K -target_address_space [get_bd_addr_spaces S00_AXI_0] [get_bd_addr_segs perceptron_14/s_axi/reg0]
assign_bd_address -offset 0x00F000 -range 4K -target_address_space [get_bd_addr_spaces S00_AXI_0] [get_bd_addr_segs perceptron_15/s_axi/reg0]
assign_bd_address -offset 0x010000 -range 4K -target_address_space [get_bd_addr_spaces S00_AXI_0] [get_bd_addr_segs perceptron_16/s_axi/reg0]
assign_bd_address -offset 0x011000 -range 4K -target_address_space [get_bd_addr_spaces S00_AXI_0] [get_bd_addr_segs perceptron_17/s_axi/reg0]
assign_bd_address -offset 0x120000 -range 4K -target_address_space [get_bd_addr_spaces S00_AXI_0] [get_bd_addr_segs image_loader_module_0/S_AXI/reg0]
assign_bd_address -offset 0x130000 -range 1K -target_address_space [get_bd_addr_spaces S00_AXI_0] [get_bd_addr_segs axi4_lite_register_m_0/s_axil/reg0]
assign_bd_address -offset 0x200000 -range 4K -target_address_space [get_bd_addr_spaces S00_AXI_0] [get_bd_addr_segs perceptron_18/s_axi/reg0]
assign_bd_address -offset 0x201000 -range 4K -target_address_space [get_bd_addr_spaces S00_AXI_0] [get_bd_addr_segs perceptron_19/s_axi/reg0]
assign_bd_address -offset 0x202000 -range 4K -target_address_space [get_bd_addr_spaces S00_AXI_0] [get_bd_addr_segs perceptron_20/s_axi/reg0]
assign_bd_address -offset 0x203000 -range 4K -target_address_space [get_bd_addr_spaces S00_AXI_0] [get_bd_addr_segs perceptron_21/s_axi/reg0]
assign_bd_address -offset 0x204000 -range 4K -target_address_space [get_bd_addr_spaces S00_AXI_0] [get_bd_addr_segs perceptron_22/s_axi/reg0]
assign_bd_address -offset 0x205000 -range 4K -target_address_space [get_bd_addr_spaces S00_AXI_0] [get_bd_addr_segs perceptron_23/s_axi/reg0]
assign_bd_address -offset 0x206000 -range 4K -target_address_space [get_bd_addr_spaces S00_AXI_0] [get_bd_addr_segs perceptron_24/s_axi/reg0]
assign_bd_address -offset 0x207000 -range 4K -target_address_space [get_bd_addr_spaces S00_AXI_0] [get_bd_addr_segs perceptron_25/s_axi/reg0]
assign_bd_address -offset 0x208000 -range 4K -target_address_space [get_bd_addr_spaces S00_AXI_0] [get_bd_addr_segs perceptron_26/s_axi/reg0]
assign_bd_address -offset 0x209000 -range 4K -target_address_space [get_bd_addr_spaces S00_AXI_0] [get_bd_addr_segs perceptron_27/s_axi/reg0]
assign_bd_address -offset 0x300000 -range 1K -target_address_space [get_bd_addr_spaces S00_AXI_0] [get_bd_addr_segs axi4_lite_register_m_1/s_axil/reg0]
assign_bd_address -offset 0x301000 -range 4K -target_address_space [get_bd_addr_spaces S00_AXI_0] [get_bd_addr_segs axi4_lite_final_outp_0/s_axil/reg0]

validate_bd_design
save_bd_design
